# Altium schematic sheet SD Card and Debug Uart.SchDoc: RK3399 COB Design V1.0
size A3; Author: AVIRAL MISHRA; DocumentNumber: 25; SheetNumber: 25; SheetTotal: 27; PROJECT CODE: A_V1.0
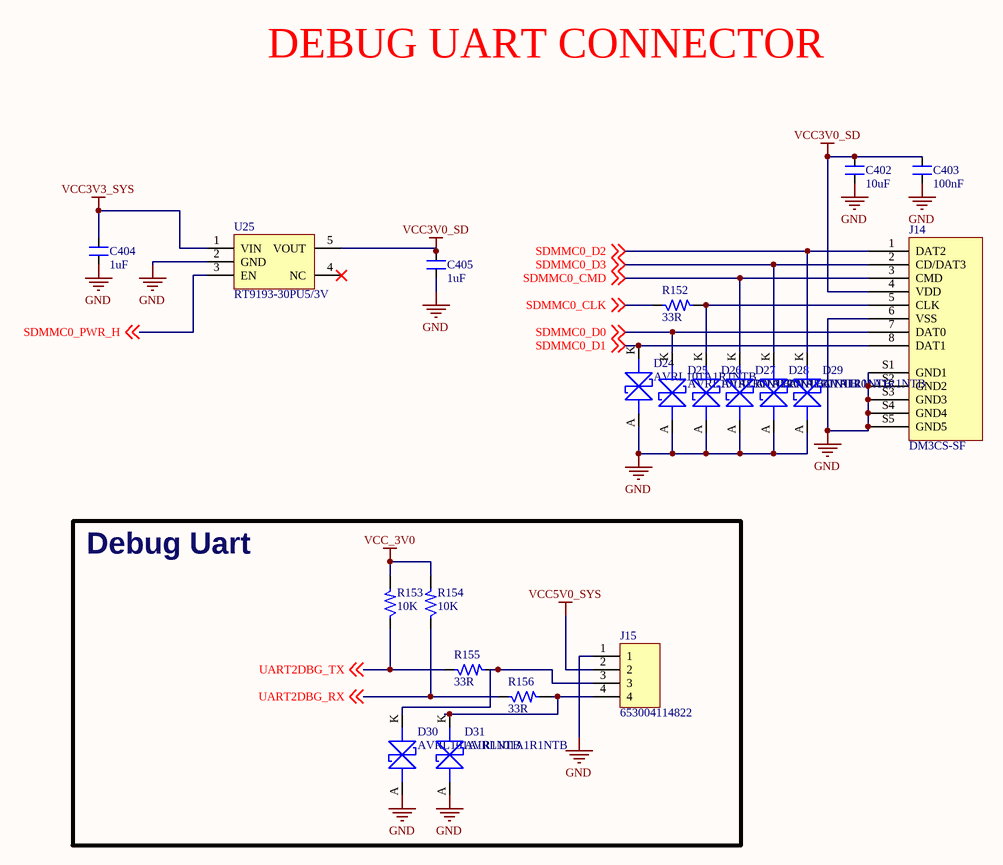
[diagram p0: SD Card and Debug Uart.SchDoc]

## Parts
C402  10uF  [CAP_0603]
C403  100nF  [CAP_0603]
C404  1uF  [CAP_0603]
C405  1uF  [CAP_0603]
D24  AVRL101A1R1NTB  [DIO_0402_SMD]
D25  AVRL101A1R1NTB  [DIO_0402_SMD]
D26  AVRL101A1R1NTB  [DIO_0402_SMD]
D27  AVRL101A1R1NTB  [DIO_0402_SMD]
D28  AVRL101A1R1NTB  [DIO_0402_SMD]
D29  AVRL101A1R1NTB  [DIO_0402_SMD]
D30  AVRL101A1R1NTB  [DIO_0402_SMD]
D31  AVRL101A1R1NTB  [DIO_0402_SMD]
J14  DM3CS-SF  [CON8_43_DM3CS-SF_SMD]
J15  653004114822  [CON4_50_653004114822_TH_ST]
R152  33R  [RES_0402]
R153  10K  [RES_0603]
R154  10K  [RES_0603]
R155  33R  [RES_0402]
R156  33R  [RES_0402]
U25  RT9193-30PU5/3V  [SOT23-5]

## Blocks framed on the sheet
Debug Uart: D30 D31 J15 R153-R156

## Nets
GND: C402.1 C403.1 C404.1 C405.1 D24.A D25.A D26.A D27.A D28.A D29.A D30.A D31.A J14.6(VSS) J14.S1(GND1) J14.S2(GND2) J14.S3(GND3) J14.S4(GND4) J14.S5(GND5) J15.1 U25.2(GND)
VCC3V0_SD: C402.2 C403.2 C405.2 J14.4(VDD) U25.5(VOUT)
VCC3V3_SYS: C404.2 U25.1(VIN)
VCC5V0_SYS: J15.2
VCC_3V0: R153.2 R154.2
SDMMC0_CLK: R152.1 ; off-sheet SDMMC0_CLK
SDMMC0_CMD: D27.K J14.3(CMD) ; off-sheet SDMMC0_CMD
SDMMC0_D0: D25.K J14.7(DAT0) ; off-sheet SDMMC0_D0
SDMMC0_D1: D24.K J14.8(DAT1) ; off-sheet SDMMC0_D1
SDMMC0_D2: D29.K J14.1(DAT2) ; off-sheet SDMMC0_D2
SDMMC0_D3: D28.K J14.2(CD/DAT3) ; off-sheet SDMMC0_D3
SDMMC0_PWR_H: U25.3(EN) ; off-sheet SDMMC0_PWR_H
UART2DBG_RX: R154.1 R156.1 ; off-sheet UART2DBG_RX
UART2DBG_TX: R153.1 R155.1 ; off-sheet UART2DBG_TX
NetD26_K: D26.K J14.5(CLK) R152.2
NetD30_K: D30.K J15.3 R155.2
NetD31_K: D31.K J15.4 R156.2

Not connected (* = marked no-connect by the designer): U25 4(NC)*

## Notes on the sheet
- DEBUG UART CONNECTOR
- TITLE:
- DOCUMENT NAME:
- SCALE 1:1
- This document is copyright of EsteemPCB and shall not be revealed, produced, copied, in whole or in part, nor
- PROJECT CODE:
- TEMPLATE:
- A4
- AUTHOR:
- Sheet
- of
- used for any purpose other than submitted.

## Library data of the parts
C402 = CAP_10uF-10V-10%-0603: 10µF ±10% 10V Ceramic Capacitor X5R 0603 (1608 Metric) /; Manufacturer Part Number: GRM188R61A106KE69J; Manufacturer: Murata Electronics; Case/Package: 0603; Supplier-1: Digikey
C403 = CAP_100nF-10V-5%-0603: 0.1µF ±10% 10V Ceramic Capacitor X7R 0603 (1608 Metric) /; Manufacturer: Yageo; Manufacturer Part Number: CC0603KRX7R6BB104; Case/Package: 0603; Supplier-1: Digikey
C404 C405 = CAP_1uF-10V-5%-0603: 1µF ±10% 10V Ceramic Capacitor X5R 0603 (1608 Metric) /; Manufacturer: Samsung Electro-Mechanics; Manufacturer Part Number: CL10A105KP8NNNC; Case/Package: 0603; Supplier-1: Digikey
D24-D31 = DIO-T_10V-39V-0402: 39V Varistor 1 Circuit Surface Mount, MLCV 0402 (1005 Metric); Manufacturer: TDK Corporation; Manufacturer Part Number: AVRL101A1R1NTB; Supplier-1: Digikey; Case/Package: 0402
J14 = CON-uSD-8X1_DM3CS-SF-SMD: Memory Card Connectors 8P R/A SMT MICRO SD HINGE PUSH-PULL; Manufacturer: Hirose Electric Co Ltd; Manufacturer Part Number: DM3CS-SF; Case/Package: SMD; Supplier-1: Digikey
J15 = CON-PLG_4X1-50-ST-TH: 4 Pins, 1 Row 1.25mm Pitch, straight Connector, male; Manufacturer: JST; Manufacturer Part Number: 653004114822; Case/Package: TH-CON; Supplier-1: WURTH
R152 R155 R156 = RES_33R-0.1W-1%-0402: 33 Ohms ±1% 0.1W, 1/10W Chip Resistor 0402 (1005 Metric) Automotive AEC-Q200 Thick Film /; Manufacturer: Panasonic Electronic Components; Manufacturer Part Number: ERJ-2RKF33R0X; Case/Package: 0402; Supplier-1: Digikey
R153 R154 = RES_10K-0.1W-1%-0603: 10 kOhms ±1% 0.1W, 1/10W Chip Resistor 0603 (1608 Metric) Thick Film /; Manufacturer: Yageo; Manufacturer Part Number: RC0603FR-0710KL; Case/Package: 0603; Supplier-1: Digikey
U25 = REG_3V-5.5V-0.3A-SC-70-5: The RT9193 is designed for portable RF and wireless / applications with demanding performance and space / requirements; Manufcaturer: RICHTEK; Manufacturer Part Number: RT9193-30PU5/3V; Case/Package: SC-70-5; Supplier-1: NA